# Altium schematic sheet sensorconn.schdoc: Sensor Connectors
size 431 x 279 mm; DrawnBy: D. Bruey, M. Ciuffo; Organization: Synapse Product Development, LLC.; Address1: 1511 6th Ave., Suite 400; Address2: Seattle, Washington 98101; Address3: 206.381.0898; Address4: www.synapse.com; DocumentNumber: 2; SheetNumber: 2; SheetTotal: 3; PageSetup: Record=PageOptions|CenterHorizontal=True|CenterVertical=True|PrintScale=1.06|XCorrection=1.00|YCorrection=1.00|PrintKind=1|BorderSize=5000000|LeftOffset=0|BottomOffset=0|Orientation=2|PaperLength=4318|PaperWidth=2794|Scale=100|PaperSource=7|PrintQuality=200|MediaType=1|DitherType=10|PrintScaleMode=1|PaperKind=11x17|PaperIndex=3
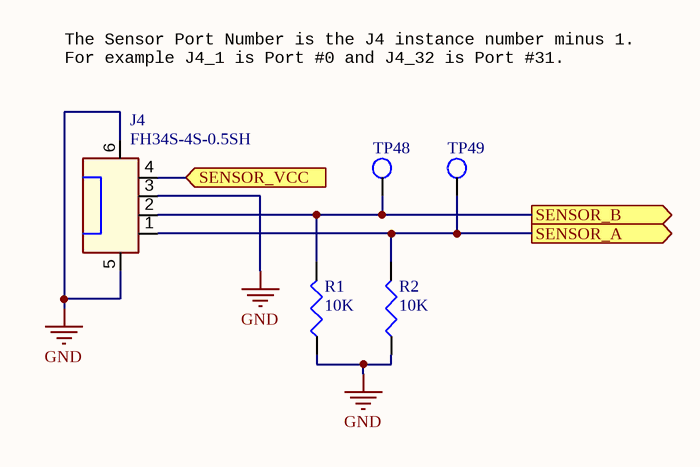
[diagram p0: sensorconn.schdoc]

## Parts
J4  FH34S-4S-0.5SH  [con_hirose_FH34SRJ-4S]
R1  10K  [0402-IPCsm_40]
R2  10K  [0402-IPCsm_40]
TP48  tp-1mm  [TP-S100_SMT]  (value not drawn)  (no BOM)
TP49  tp-1mm  [TP-S100_SMT]  (value not drawn)  (no BOM)

## Ports
SENSOR_A (out), SENSOR_B (out), SENSOR_VCC (in)

## Nets
GND: J4.3 J4.5(TAB1) J4.6(TAB2) R1.1 R2.1
SENSOR_A: J4.1 R2.2 TP49.1(TP) ; port SENSOR_A
SENSOR_B: J4.2 R1.2 TP48.1(TP) ; port SENSOR_B
SENSOR_VCC: J4.4 ; port SENSOR_VCC

## Notes on the sheet
- The Sensor Port Number is the J4 instance number minus 1.
  For example J4_1 is Port #0 and J4_32 is Port #31.
- Design Notes:
- Layout Notes:
- Project:
- Sheet Title:
- PCBA:
- PROPRIETARY AND CONFIDENTIAL
- Drawn by:
- Schematic Part Number:
- Schematic Revision:
- Date:
- Sheet:
- /

## Library data of the parts
J4 = FH34S-4S-0.5SH: CONN FFC FPC 4POS 0.50MM R/A; part_type: ffc/fpc; id: 1604; mfg: HIROSE; dist: MOUSER; dist_pn: 798-FH34S-4S-0.5SH50; symbol: \\synapsedev.com\dfs\FS\EE_STUFF\CAD_LIB\MASTER\MASTER_CON\HEADER 4 TABS; positions: 4; layout_notes: Top Contacts; OrCADSymbol: MASTER_CON\HEADER 4 TABS; TableName: viewAltiumConnectors; mfg_pn: FH34S-4S-0.5SH; allegro_footprint: con_hirose_FH34SRJ-4S; height: 1.1mm; status: Unknown; SymbolPath: C:\EE-Vault\Libraries\Schematic\MASTER_CON\HEADER 4 TABS
R1 R2 = RC0402JR-0710KL: RES 10.0K OHM 1/16W 5% 0402 SMD; part_type: resistor; Allegro_footprint: 0402-IPCsm_40,r-0402_16H; Tolerance: 5.00%; Voltage: 50V; DIST: DIGIKEY; MFG: YAGEO AMERICA; DIST_PN: 311-10KJRCT-ND; Power: 0.063W; id: 1219; symbol: \\synapsedev.com\dfs\FS\EE_STUFF\CAD_LIB\MASTER\MASTER_DISCRETE\RES; source_package: R_10K_5P_0402; OrCADSymbol: MASTER_DISCRETE\RES; TableName: viewAltiumResistors; Height: .4MM; MFG_PN: RC0402JR-0710KL; status: Unknown; SymbolPath: C:\EE-Vault\Libraries\Schematic\MASTER_DISCRETE\RES
TP48 TP49 = TP0042: TESTPOINT, 1MM SMD, Square pad, Round SM opening; part_type: test_point; mfg_pn: TP0042; mfg: NA; id: 888; symbol: \\synapsedev.com\dfs\FS\EE_STUFF\CAD_LIB\MASTER\MASTER_MISC\TP_SMT; OrCADSymbol: MASTER_MISC\TP_SMT; TableName: viewAltiumMisc; dist: NA; dist_pn: NA; source_package: tp_smt; status: Unknown; allegro_footprint: TP-S100_SMT; SymbolPath: C:\EE-Vault\Libraries\Schematic\MASTER_MISC\TP_SMT